# Altium schematic sheet 10 DDR3 RAM.SchDoc
size A3
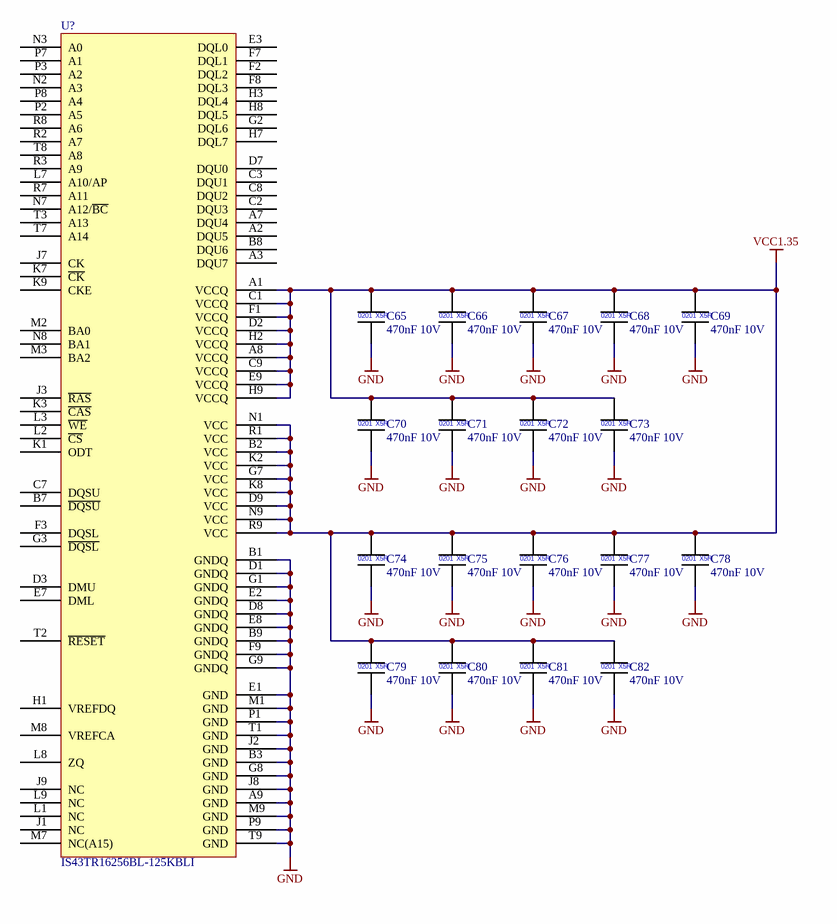
[diagram p0: 10 DDR3 RAM.SchDoc]

## Parts
C65  470nF 10V  [CAPC0603X03L]
C66  470nF 10V  [CAPC0603X03L]
C67  470nF 10V  [CAPC0603X03L]
C68  470nF 10V  [CAPC0603X03L]
C69  470nF 10V  [CAPC0603X03L]
C70  470nF 10V  [CAPC0603X03L]
C71  470nF 10V  [CAPC0603X03L]
C72  470nF 10V  [CAPC0603X03L]
C73  470nF 10V  [CAPC0603X03L]
C74  470nF 10V  [CAPC0603X03L]
C75  470nF 10V  [CAPC0603X03L]
C76  470nF 10V  [CAPC0603X03L]
C77  470nF 10V  [CAPC0603X03L]
C78  470nF 10V  [CAPC0603X03L]
C79  470nF 10V  [CAPC0603X03L]
C80  470nF 10V  [CAPC0603X03L]
C81  470nF 10V  [CAPC0603X03L]
C82  470nF 10V  [CAPC0603X03L]
U?  IS43TR16256BL-125KBLI  [BGA96C80P9X16_900X1300X120]

## Nets
GND: C65.2 C66.2 C67.2 C68.2 C69.2 C70.2 C71.2 C72.2 C73.2 C74.2 C75.2 C76.2 C77.2 C78.2 C79.2 C80.2 C81.2 C82.2 U?.A9(GND) U?.B1(GNDQ) U?.B3(GND) U?.B9(GNDQ) U?.D1(GNDQ) U?.D8(GNDQ) U?.E1(GND) U?.E2(GNDQ) U?.E8(GNDQ) U?.F9(GNDQ) U?.G1(GNDQ) U?.G8(GND) U?.G9(GNDQ) U?.J2(GND) U?.J8(GND) U?.M1(GND) U?.M9(GND) U?.P1(GND) U?.P9(GND) U?.T1(GND) U?.T9(GND)
VCC1.35: C65.1 C66.1 C67.1 C68.1 C69.1 C70.1 C71.1 C72.1 C73.1 C74.1 C75.1 C76.1 C77.1 C78.1 C79.1 C80.1 C81.1 C82.1 U?.A1(VCCQ) U?.A8(VCCQ) U?.B2(VCC) U?.C1(VCCQ) U?.C9(VCCQ) U?.D2(VCCQ) U?.D9(VCC) U?.E9(VCCQ) U?.F1(VCCQ) U?.G7(VCC) U?.H2(VCCQ) U?.H9(VCCQ) U?.K2(VCC) U?.K8(VCC) U?.N1(VCC) U?.N9(VCC) U?.R1(VCC) U?.R9(VCC)

Not connected (* = marked no-connect by the designer): U? A2(DQU5) A3(DQU7) A7(DQU4) B7(~{DQSU}) B8(DQU6) C2(DQU3) C3(DQU1) C7(DQSU) C8(DQU2) D3(DMU) D7(DQU0) E3(DQL0) E7(DML) F2(DQL2) F3(DQSL) F7(DQL1) F8(DQL3) G2(DQL6) G3(~{DQSL}) H1(VREFDQ) H3(DQL4) H7(DQL7) H8(DQL5) J1(NC) J3(~{RAS}) J7(CK) J9(NC) K1(ODT) K3(~{CAS}) K7(~{CK}) K9(CKE) L1(NC) L2(~{CS}) L3(~{WE}) L7(A10/AP) L8(ZQ) L9(NC) M2(BA0) M3(BA2) M7(NC(A15)) M8(VREFCA) N2(A3) N3(A0) N7(A12/~{BC}) N8(BA1) P2(A5) P3(A2) P7(A1) P8(A4) R2(A7) R3(A9) R7(A11) R8(A6) T2(~{RESET}) T3(A13) T7(A14) T8(A8)

## Notes on the sheet
- Title:
- ++CONFIDENTIAL++
- Datum:
- Blatt:
- von:
- Zeit:
- Entwickler:
- Der transparenteste Entwicklungsdienstleister
  der Elektronik- und Softwareentwicklung
- The  information  contained  in  these  documents  is  confidential,  privileged  and  only  for  the
  information of the intended recipient and may
  not be used, published or redistributed without
  the prior written consent from PCB Arts GmbH.
- Revision:
- Checked:
- https://pcb-arts.com/
- mail@pcb-arts.com
- (in symbol CAP_0201_470nF_10V) 0201; X5R

## Library data of the parts
C65-C82 = CAP_0201_470nF_10V: Multilayer Ceramic Capacitors MLCC - SMD/SMT 0201 10VDC; Manufacturer 1: Taiyo Yuden; Manufacturer 1 Prt. Nr.: LMK063BBJ474KPLF; Manufacturer 2 Prt. Nr.: C0603X5R1A474M030BC; Manufacturer 2: TDK
U? = IS43TR16256BL-125KBLI_DRAM 4G, 1.35V, DDR3L, 256Mx16: DRAM 4G, 1.35V, DDR3L, 256Mx16, 1600MT/s @ 11-11-11, 96 ball BGA (9mm x13mm) RoHS, IT; Manufacturer 1: ISSI; Manufacturer 1 Prt. Nr.: IS43TR16256BL-125KBLI